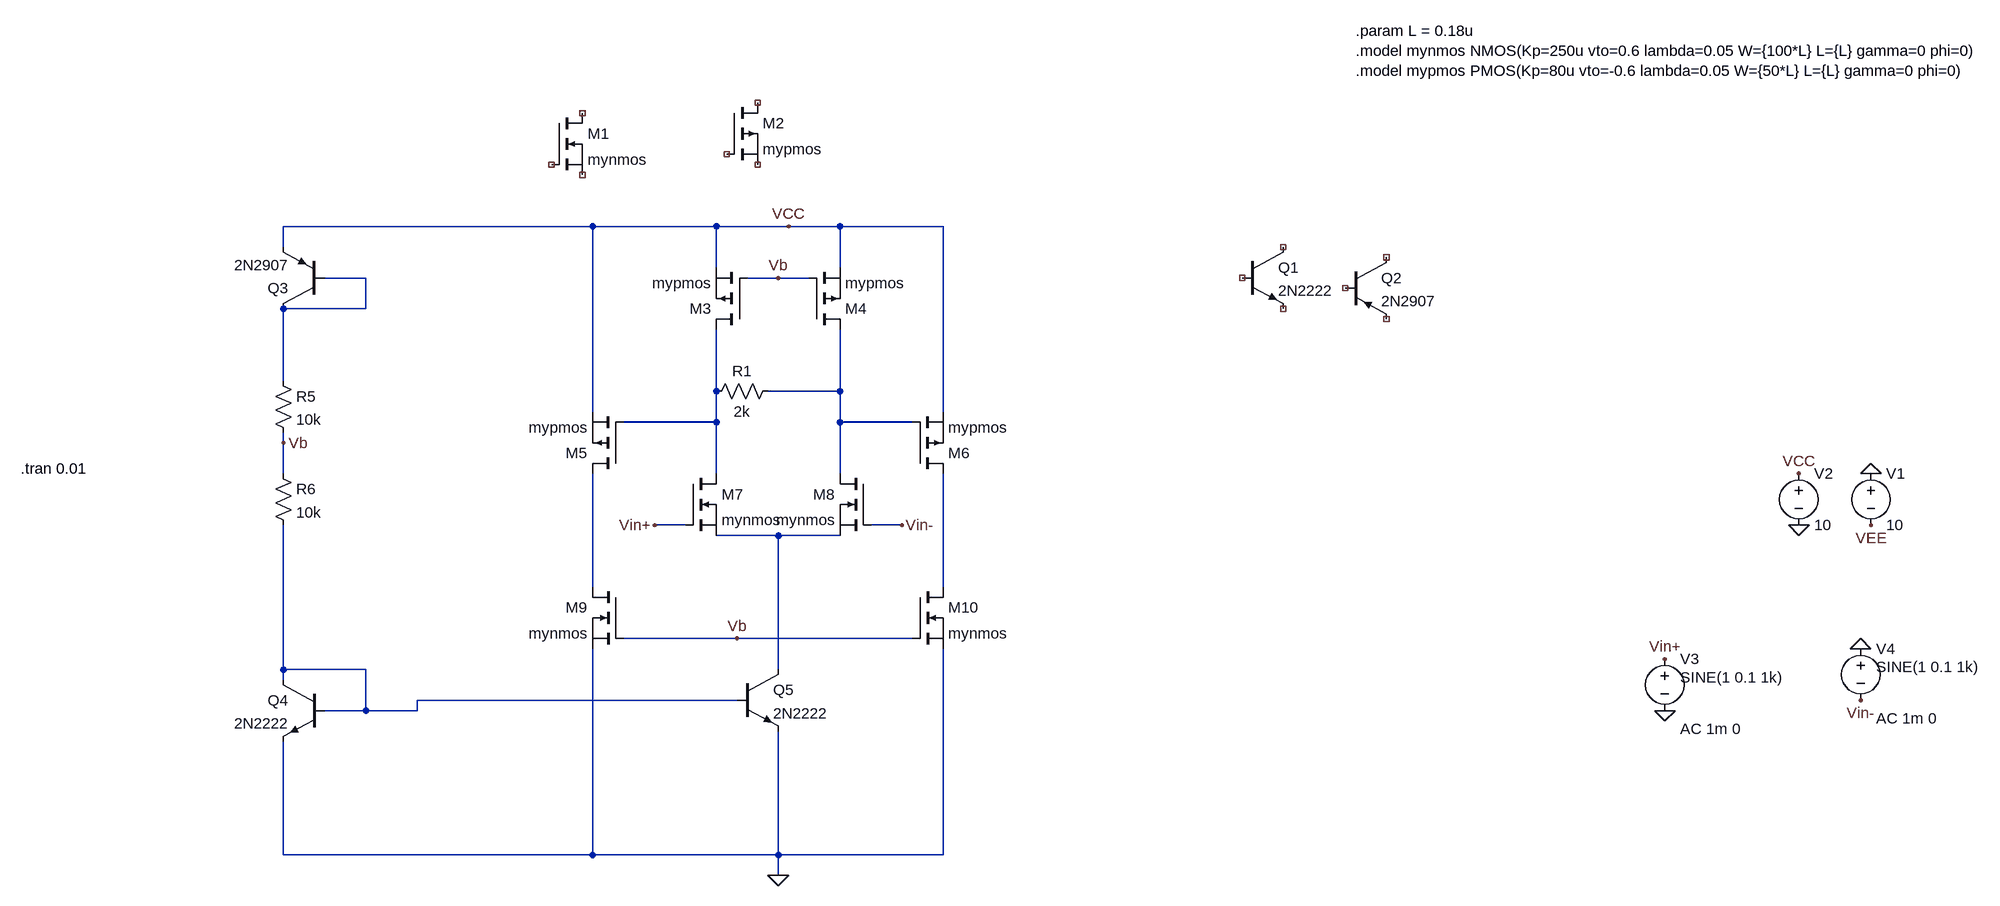
[diagram p0: schematic Draft1.asc]
Draft1.asc, the LTspice schematic file:
Version 4.1
SHEET 1 2156 920
WIRE -112 -272 -592 -272
WIRE 80 -272 -112 -272
WIRE 192 -272 80 -272
WIRE 272 -272 192 -272
WIRE 432 -272 272 -272
WIRE -592 -240 -592 -272
WIRE 80 -208 80 -272
WIRE 272 -208 272 -272
WIRE -464 -192 -528 -192
WIRE 176 -192 128 -192
WIRE 224 -192 176 -192
WIRE -464 -144 -464 -192
WIRE -464 -144 -592 -144
WIRE -592 -32 -592 -144
WIRE 80 -16 80 -112
WIRE 272 -16 272 -112
WIRE 272 -16 160 -16
WIRE -112 16 -112 -272
WIRE 432 16 432 -272
WIRE 80 32 80 -16
WIRE 80 32 -64 32
WIRE 272 32 272 -16
WIRE 384 32 272 32
WIRE -592 64 -592 48
WIRE -592 112 -592 64
WIRE 80 112 80 32
WIRE 272 112 272 32
WIRE 32 192 -16 192
WIRE 368 192 320 192
WIRE 176 208 80 208
WIRE 272 208 176 208
WIRE -112 288 -112 112
WIRE 432 288 432 112
WIRE 112 368 -64 368
WIRE 384 368 112 368
WIRE -592 416 -592 192
WIRE -464 416 -592 416
WIRE 176 416 176 208
WIRE -592 432 -592 416
WIRE 112 464 -384 464
WIRE -464 480 -464 416
WIRE -464 480 -528 480
WIRE -384 480 -384 464
WIRE -384 480 -464 480
WIRE -592 704 -592 528
WIRE -112 704 -112 384
WIRE -112 704 -592 704
WIRE 176 704 176 512
WIRE 176 704 -112 704
WIRE 432 704 432 384
WIRE 432 704 176 704
WIRE 176 736 176 704
FLAG 1872 192 VEE
FLAG 1760 112 VCC
FLAG 1760 192 0
FLAG 1872 112 0
FLAG 1552 480 0
FLAG 1856 384 0
FLAG 1552 400 Vin+
FLAG 1856 464 Vin-
FLAG 176 736 0
FLAG 192 -272 VCC
FLAG -16 192 Vin+
FLAG 368 192 Vin-
FLAG -592 64 Vb
FLAG 112 368 Vb
FLAG 176 -192 Vb
SYMBOL voltage 1872 96 R0
WINDOW 123 0 0 Left 0
WINDOW 39 0 0 Left 0
SYMATTR InstName V1
SYMATTR Value 10
SYMBOL voltage 1760 96 R0
WINDOW 123 0 0 Left 0
WINDOW 39 0 0 Left 0
SYMATTR InstName V2
SYMATTR Value 10
SYMBOL voltage 1552 384 R0
WINDOW 123 24 124 Left 2
WINDOW 39 0 0 Left 0
WINDOW 3 24 44 Left 2
SYMATTR Value2 AC 1m 0
SYMATTR InstName V3
SYMATTR Value SINE(1 0.1 1k)
SYMBOL voltage 1856 368 R0
WINDOW 123 24 124 Left 2
WINDOW 39 0 0 Left 0
WINDOW 3 24 44 Left 2
SYMATTR Value2 AC 1m 0
SYMATTR InstName V4
SYMATTR Value SINE(1 0.1 1k)
SYMBOL nmos -176 -448 R0
SYMATTR InstName M1
SYMATTR Value mynmos
SYMBOL pmos 96 -464 R0
SYMATTR InstName M2
SYMATTR Value mypmos
SYMBOL pmos 128 -112 R180
SYMATTR InstName M3
SYMATTR Value mypmos
SYMBOL pmos 224 -112 M180
SYMATTR InstName M4
SYMATTR Value mypmos
SYMBOL pmos -64 112 R180
SYMATTR InstName M5
SYMATTR Value mypmos
SYMBOL pmos 384 112 M180
SYMATTR InstName M6
SYMATTR Value mypmos
SYMBOL nmos 32 112 R0
SYMATTR InstName M7
SYMATTR Value mynmos
SYMBOL nmos 320 112 M0
SYMATTR InstName M8
SYMATTR Value mynmos
SYMBOL nmos -64 288 M0
SYMATTR InstName M9
SYMATTR Value mynmos
SYMBOL nmos 384 288 R0
SYMATTR InstName M10
SYMATTR Value mynmos
SYMBOL res -608 -48 R0
SYMATTR InstName R5
SYMATTR Value 10k
SYMBOL res -608 96 R0
SYMATTR InstName R6
SYMATTR Value 10k
SYMBOL npn 896 -240 R0
SYMATTR InstName Q1
SYMATTR Value 2N2222
SYMBOL pnp 1056 -224 R0
SYMATTR InstName Q2
SYMATTR Value 2N2907
SYMBOL pnp -528 -144 R180
SYMATTR InstName Q3
SYMATTR Value 2N2907
SYMBOL npn -528 432 M0
SYMATTR InstName Q4
SYMATTR Value 2N2222
SYMBOL npn 112 416 R0
SYMATTR InstName Q5
SYMATTR Value 2N2222
SYMBOL res 176 -32 R90
WINDOW 0 0 56 VBottom 2
WINDOW 3 32 56 VTop 2
SYMATTR InstName R1
SYMATTR Value 2k
TEXT 1072 -576 Left 2 !.param L = 0.18u\n.model mynmos NMOS(Kp=250u vto=0.6 lambda=0.05 W={100*L} L={L} gamma=0 phi=0)\n.model mypmos PMOS(Kp=80u vto=-0.6 lambda=0.05 W={50*L} L={L} gamma=0 phi=0)
TEXT -1000 104 Left 2 !.tran 0.01

The netlist it stands for:
* Draft1.asc
V1 0 VEE 10
V2 VCC 0 10
V3 Vin+ 0 SINE(1 0.1 1k) AC 1m 0
V4 0 Vin- SINE(1 0.1 1k) AC 1m 0
M1 NC_01 NC_02 NC_03 NC_03 mynmos
M2 NC_04 NC_05 NC_06 NC_06 mypmos
M3 N002 Vb VCC VCC mypmos
M4 N003 Vb VCC VCC mypmos
M5 N005 N002 VCC VCC mypmos
M6 N006 N003 VCC VCC mypmos
M7 N002 Vin+ N004 N004 mynmos
M8 N003 Vin- N004 N004 mynmos
M9 N005 Vb 0 0 mynmos
M10 N006 Vb 0 0 mynmos
R5 N001 Vb 10k
R6 Vb N007 10k
Q1 NC_07 NC_08 NC_09 0 2N2222
Q2 NC_10 NC_11 NC_12 0 2N2907
Q3 N001 N001 VCC 0 2N2907
Q4 N007 N007 0 0 2N2222
Q5 N004 N007 0 0 2N2222
R1 N003 N002 2k
.model NPN NPN
.model PNP PNP
.lib standard.bjt
.model NMOS NMOS
.model PMOS PMOS
.lib standard.mos
.param L = 0.18u
.model mynmos NMOS(Kp=250u vto=0.6 lambda=0.05 W={100*L} L={L} gamma=0 phi=0)
.model mypmos PMOS(Kp=80u vto=-0.6 lambda=0.05 W={50*L} L={L} gamma=0 phi=0)
.tran 0.01
.backanno
.end